# EAGLE design EnsembleNine (EAGLE 7.6.0)
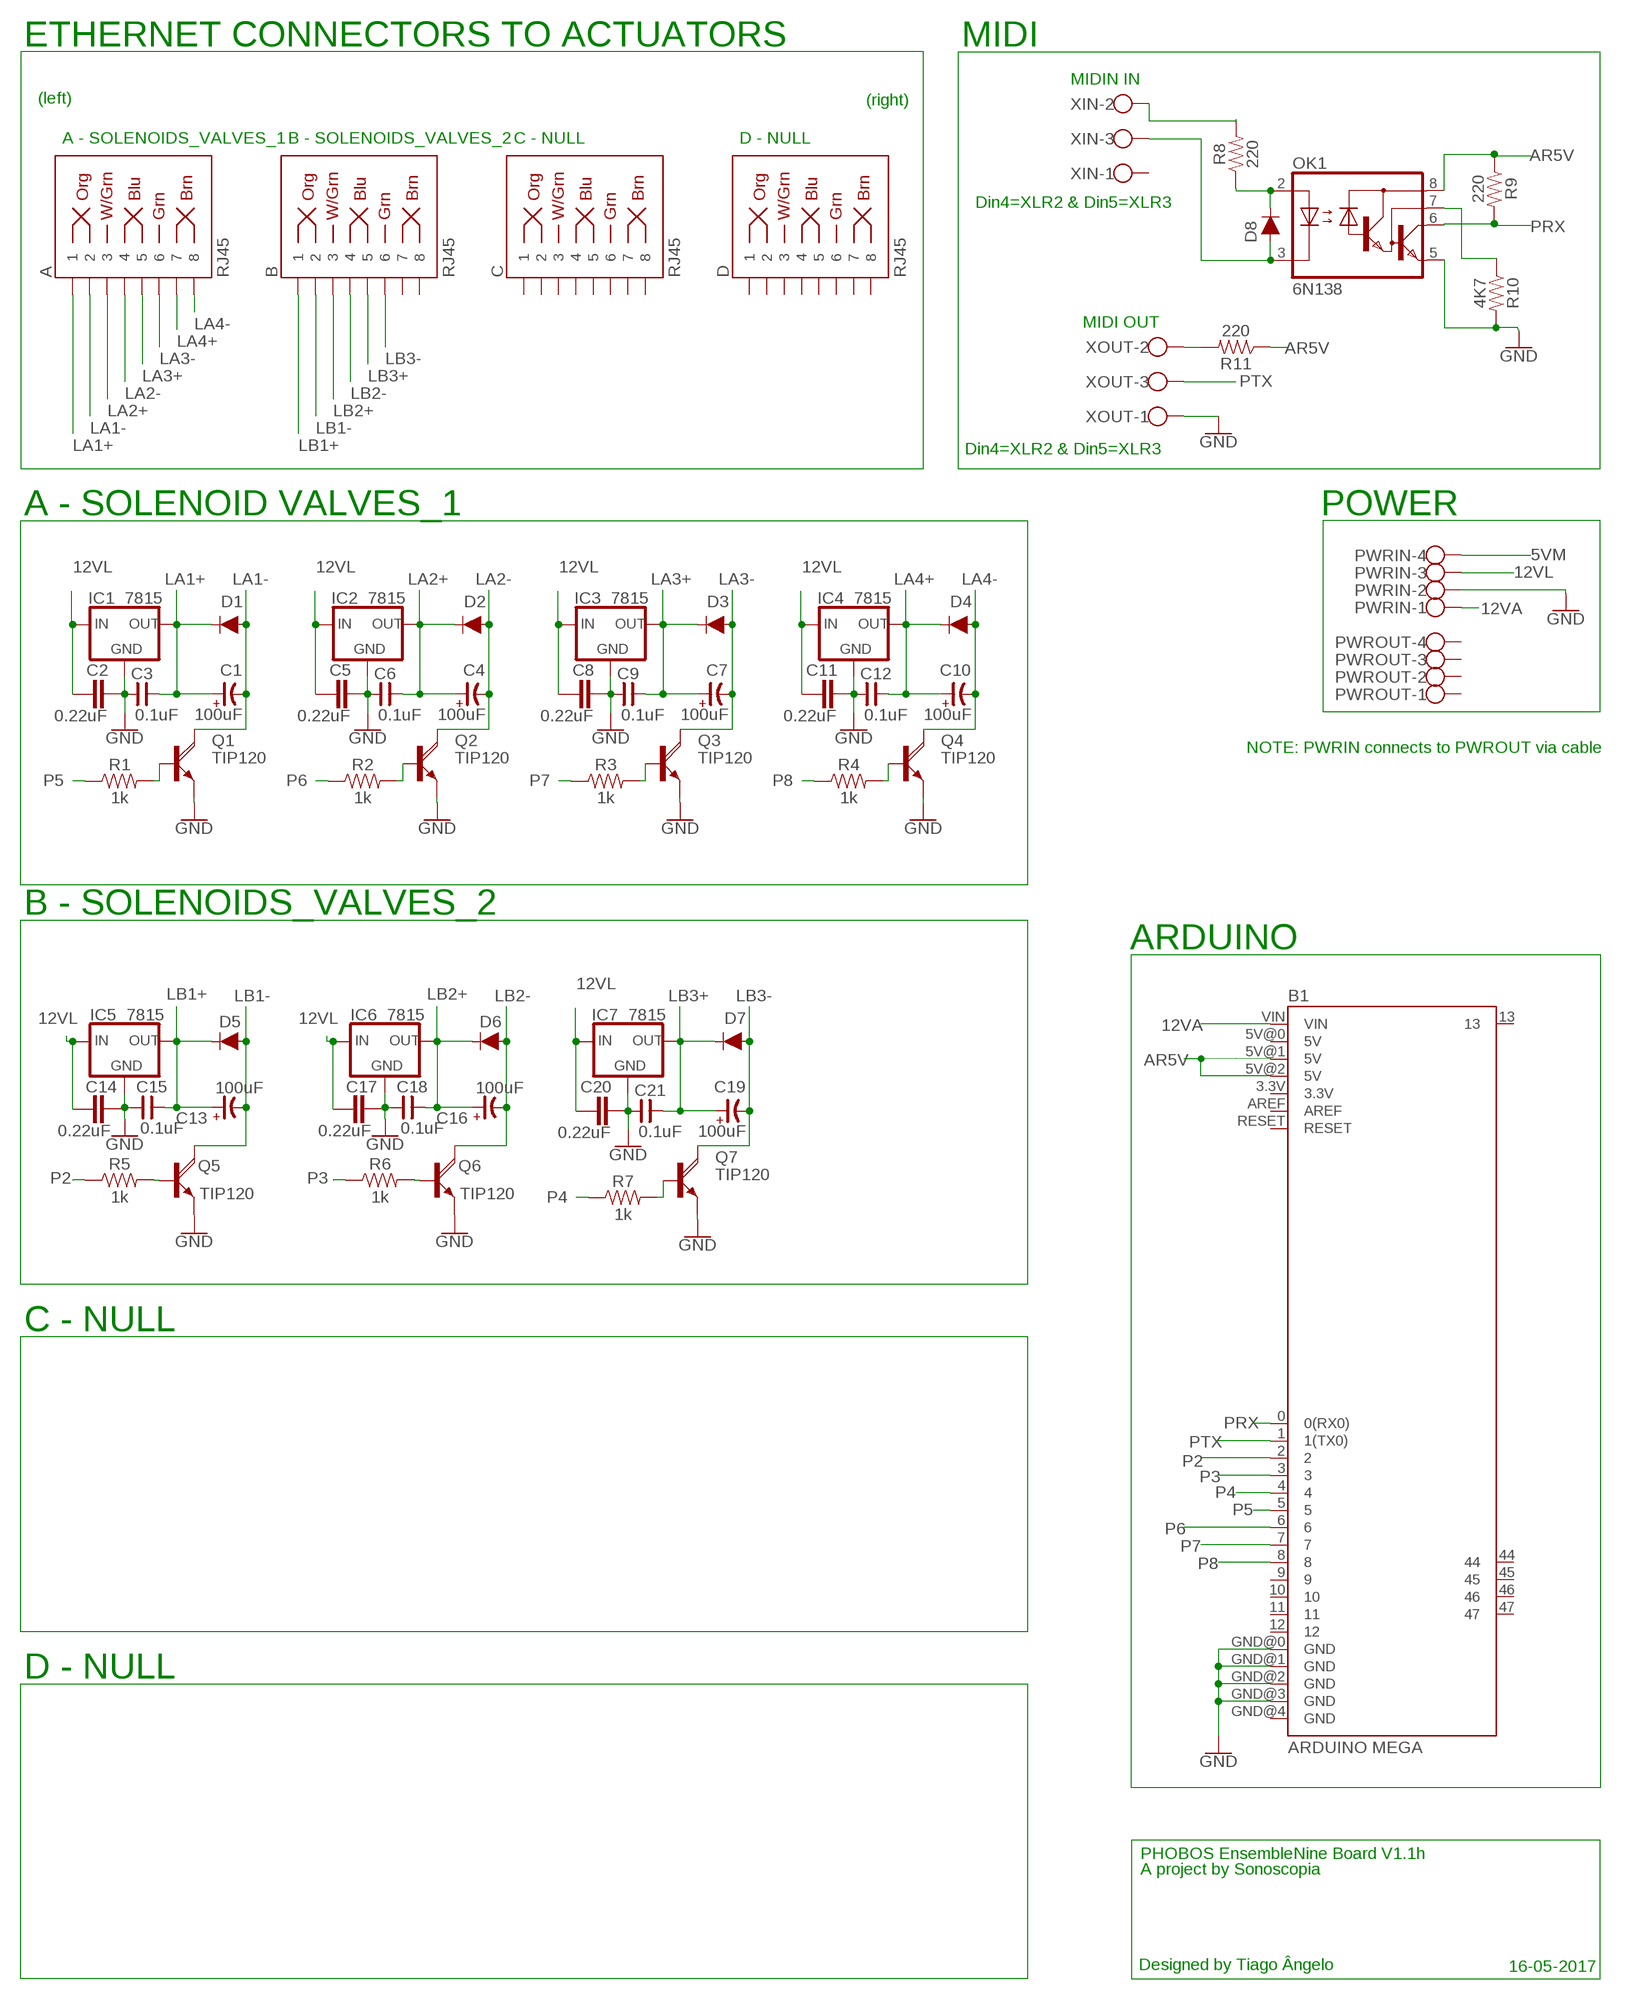
[diagram p0: schematic, sheet 1]

## Parts
A  RJ45  RJ45-8  [RJ45-8]
B  RJ45  RJ45-8  [RJ45-8]
B1  ARDUINO MEGA  ARDUINO_MEGA_R3FULL  [ARDUINO_MEGA]
C  RJ45  RJ45-8  [RJ45-8]
C1  100uF  CAP-MASTER_CP-E-020X050  [CAP-MASTER_E-020X050]
C2  0.22uF  C5/3  [C5B3]
C3  0.1uF  CNP-C025-050X025  [C025-050X025]
C4  100uF  CAP-MASTER_CP-E-020X050  [CAP-MASTER_E-020X050]
C5  0.22uF  C5/3  [C5B3]
C6  0.1uF  CNP-C025-050X025  [C025-050X025]
C7  100uF  CAP-MASTER_CP-E-020X050  [CAP-MASTER_E-020X050]
C8  0.22uF  C5/3  [C5B3]
C9  0.1uF  CNP-C025-050X025  [C025-050X025]
C10  100uF  CAP-MASTER_CP-E-020X050  [CAP-MASTER_E-020X050]
C11  0.22uF  C5/3  [C5B3]
C12  0.1uF  CNP-C025-050X025  [C025-050X025]
C13  100uF  CP-E-020X050  [E-020X050]
C14  0.22uF  C5/3  [C5B3]
C15  0.1uF  CNP-C025-050X025  [C025-050X025]
C16  100uF  CP-E-020X050  [E-020X050]
C17  0.22uF  C5/3  [C5B3]
C18  0.1uF  CNP-C025-050X025  [C025-050X025]
C19  100uF  CAP-MASTER_CP-E-020X050  [CAP-MASTER_E-020X050]
C20  0.22uF  C5/3  [C5B3]
C21  0.1uF  CNP-C025-050X025  [C025-050X025]
D  RJ45  RJ45-8  [RJ45-8]
D1  1A/50V/1.1V  DIODE-KIT2  [DIODE-1N4001-KIT]
D2  1A/50V/1.1V  DIODE-KIT2  [DIODE-1N4001-KIT]
D3  1A/50V/1.1V  DIODE-KIT2  [DIODE-1N4001-KIT]
D4  1A/50V/1.1V  DIODE-KIT2  [DIODE-1N4001-KIT]
D5  1A/50V/1.1V  DIODE-KIT2  [DIODE-1N4001-KIT]
D6  1A/50V/1.1V  DIODE-KIT2  [DIODE-1N4001-KIT]
D7  1A/50V/1.1V  DIODE-KIT2  [DIODE-1N4001-KIT]
D8  200mA/100V/1V  DIODE-1N4148  [DIODE-1N4148]
IC1  7815  78XXS  [78XXS]
IC2  7815  78XXS  [78XXS]
IC3  7815  78XXS  [78XXS]
IC4  7815  78XXS  [78XXS]
IC5  7815  78XXS  [78XXS]
IC6  7815  78XXS  [78XXS]
IC7  7815  78XXS  [78XXS]
OK1  6N138  [DIL08]
PWRIN  W237-4  [W237-4]
PWROUT  W237-4  [W237-4]
Q1  TIP120  ROCKETFARM_TIP120V  [ROCKETFARM_TO220AV]
Q2  TIP120  ROCKETFARM_TIP120V  [ROCKETFARM_TO220AV]
Q3  TIP120  ROCKETFARM_TIP120V  [ROCKETFARM_TO220AV]
Q4  TIP120  ROCKETFARM_TIP120V  [ROCKETFARM_TO220AV]
Q5  TIP120  TIP120V  [TO220AV]
Q6  TIP120  TIP120V  [TO220AV]
Q7  TIP120  ROCKETFARM_TIP120V  [ROCKETFARM_TO220AV]
R1  1k  1KOHM-VERT-1/4W-1%  [AXIAL-0.1]
R2  1k  1KOHM-VERT-1/4W-1%  [AXIAL-0.1]
R3  1k  1KOHM-VERT-1/4W-1%  [AXIAL-0.1]
R4  1k  1KOHM-VERT-1/4W-1%  [AXIAL-0.1]
R5  1k  1KOHM-VERT-1/4W-1%  [AXIAL-0.1]
R6  1k  1KOHM-VERT-1/4W-1%  [AXIAL-0.1]
R7  1k  1KOHM-VERT-1/4W-1%  [AXIAL-0.1]
R8  220  1KOHM-HORIZ-1/4W-5%  [AXIAL-0.3]
R9  220  1KOHM-HORIZ-1/4W-5%  [AXIAL-0.3]
R10  4K7  1KOHM-HORIZ-1/4W-5%  [AXIAL-0.3]
R11  220  1KOHM-HORIZ-1/4W-5%  [AXIAL-0.3]
XIN  W237-103  [W237-103]
XOUT  W237-103  [W237-103]

## Nets
5VM [5VM]: PWRIN.4
12VA [12VA]: B1.VIN PWRIN.1
12VL [12VL]: C2.1 C5.1 C8.1 C11.1 C14.1 C17.1 C20.1 IC1.IN IC2.IN IC3.IN IC4.IN IC5.IN IC6.IN IC7.IN PWRIN.3
AR5V: B1.5V@1(5V) B1.5V@2(5V) OK1.8(VCC) R9.P$1 R11.P$1
GND [GND]: B1.GND@0(GND) B1.GND@1(GND) B1.GND@2(GND) B1.GND@3(GND) C2.2 C3.1 C5.2 C6.1 C8.2 C9.1 C11.2 C12.1 C14.2 C15.1 C17.2 C18.1 C20.2 C21.1 IC1.GND IC2.GND IC3.GND IC4.GND IC5.GND IC6.GND IC7.GND OK1.5(GND) PWRIN.2 Q1.E Q2.E Q3.E Q4.E Q5.E Q6.E Q7.E R10.P$2 XOUT.1
LA1+: A.1 C1.+ C3.2 D1.C IC1.OUT
LA1-: A.2 C1.- D1.A Q1.C
LA2+: A.3 C4.+ C6.2 D2.C IC2.OUT
LA2-: A.4 C4.- D2.A Q2.C
LA3+: A.5 C7.+ C9.2 D3.C IC3.OUT
LA3-: A.6 C7.- D3.A Q3.C
LA4+: A.7 C10.+ C12.2 D4.C IC4.OUT
LA4-: A.8 C10.- D4.A Q4.C
LB1+: B.1 C13.+ C15.2 D5.C IC5.OUT
LB1-: B.2 C13.- D5.A Q5.C
LB2+: B.3 C16.+ C18.2 D6.C IC6.OUT
LB2-: B.4 C16.- D6.A Q6.C
LB3+: B.5 C19.+ C21.2 D7.C IC7.OUT
LB3-: B.6 C19.- D7.A Q7.C
N$1: Q3.B R3.P$2
N$2: R11.P$2 XOUT.2
N$3: Q4.B R4.P$2
N$4: Q6.B R6.P$2
N$9: Q5.B R5.P$2
N$16: Q7.B R7.P$2
N$18: Q1.B R1.P$2
N$19: Q2.B R2.P$2
N$25: D8.A OK1.3(C) XIN.3
N$26: D8.C OK1.2(A) R8.P$1
N$27: R8.P$2 XIN.2
N$29: OK1.7(VB) R10.P$1
P2: B1.2 R5.P$1
P3: B1.3 R6.P$1
P4: B1.4 R7.P$1
P5: B1.5 R1.P$1
P6: B1.6 R2.P$1
P7: B1.7 R3.P$1
P8: B1.8 R4.P$1
PRX: B1.0(0(RX0)) OK1.6(VO) R9.P$2
PTX: B1.1(1(TX0)) XOUT.3
Unconnected: B1.3.3V B1.5V@0(5V) B1.9 B1.10 B1.11 B1.12 B1.13 B1.44 B1.45 B1.46 B1.47 B1.AREF B1.GND@4(GND) B1.RESET B.7 B.8 C.1 C.2 C.3 C.4 C.5 C.6 C.7 C.8 D.1 D.2 D.3 D.4 D.5 D.6 D.7 D.8 PWROUT.1 PWROUT.2 PWROUT.3 PWROUT.4 XIN.1

## Notes on the sheet
- ETHERNET CONNECTORS TO ACTUATORS | MIDI
- MIDIN IN
- (left) | (right)
- A - SOLENOIDS_VALVES_1 | B - SOLENOIDS_VALVES_2 | C - NULL | D - NULL
- Din4=XLR2 & Din5=XLR3
- MIDI OUT
- Din4=XLR2 & Din5=XLR3
- A - SOLENOID VALVES_1 | POWER
- NOTE: PWRIN connects to PWROUT via cable
- B - SOLENOIDS_VALVES_2
- ARDUINO
- C - NULL
- D - NULL
- PHOBOS EnsembleNine Board V1.1h
- A project by Sonoscopia
- Designed by Tiago Ângelo | 16-05-2017

## Library data of the parts
A B C D = SparkFun-Connectors:RJ45-8: RJ45 Jack - 8 pin Simple RJ45, 8-pin connection. Commonly used for Cat5, Cat5e, and Cat6 Ethernet cables. Here is the connector we sell at SparkFun: RJ45 8-Pin Connector <https://www.sparkfun.com/products/643> (PRT-00643) Datasheet <https://cdn.sparkfun.com/datasheets/Prototyping/04908.pdf> It is used on this SparkFun product: SparkFun RJ45 Breakout <https://www.sparkfun.com/products/716> (BOB-00716) Note, you may also be interested in the "MAGJACK" version of this. It is basically a RJ45 connector, but also has some status LEDs built into the connector housing. You can check that out in this library at the device named "MAGJACK.dev" and see these products online: RJ45 Ethernet MagJack-Compatible <https://www.sparkfun.com/products/8534> (PRT-08534) SparkFun RJ45 MagJack Breakout <https://www.sparkfun.com/products/13021> (BOB-13021); PROD_ID: CONN-08506; SF_ID: PRT-00643
B1 = PHOBOS-Boards:ARDUINO_MEGA_R3: Arduino Mega R3 ATmega2560 R3 compatible footprint. SparkFun Products: Arduino Mega 2560 R3 <https://www.sparkfun.com/products/11061>
C1 C4 C7 C10 C19 = PHOBOS-lbr:CAP-MASTER_CP-: POLARIZED CAP
C2 C5 C8 C11 C14 C17 C20 = capacitor-wima:C: CAPACITOR naming: grid - package width
C3 C6 C9 C12 C15 C18 C21 = cap-master:CNP-: NON-POLARIZED CAP
C13 C16 = cap-master:CP-: POLARIZED CAP
D1-D7 = SparkFun-DiscreteSemi:DIODE: Diode These are standard reverse protection diodes and small signal diodes. SparkFun Products: SparkFun SparkPunk Sound Kit <https://www.sparkfun.com/products/11177> SparkFun ESP8266 Thing <https://www.sparkfun.com/products/13231>; PROD_ID: DIO-09176
D8 = SparkFun-DiscreteSemi:DIODE: Diode These are standard reverse protection diodes and small signal diodes. SparkFun Products: SparkFun SparkPunk Sound Kit <https://www.sparkfun.com/products/11177> SparkFun ESP8266 Thing <https://www.sparkfun.com/products/13231>; PROD_ID: DIO-08378
IC1-IC7 = v-reg:78XXS: VOLTAGE REGULATOR
OK1 = optocoupler:6N138: MOTOROLA OPTO COUPLER; MF: VISHAY/TELEFUNKEN; MPN: 6N138; OC_FARNELL: 9860150; OC_NEWARK: 35K5294
PWRIN PWROUT = con-wago-500:W237-4: WAGO SCREW CLAMP; OC_FARNELL: unknown; OC_NEWARK: unknown
Q1-Q4 Q7 = PHOBOS-lbr:ROCKETFARM_TIP120: NPN DARLINGTON TRANSISTOR
Q5 Q6 = rocketfarm:TIP120: NPN DARLINGTON TRANSISTOR
R1-R7 = SparkFun-Resistors:1KOHM: 1kΩ resistor A resistor is a passive two-terminal electrical component that implements electrical resistance as a circuit element. Resistors act to reduce current flow, and, at the same time, act to lower voltage levels within circuits. - Wikipedia; PROD_ID: RES-12182
R8-R11 = SparkFun-Resistors:1KOHM: 1kΩ resistor A resistor is a passive two-terminal electrical component that implements electrical resistance as a circuit element. Resistors act to reduce current flow, and, at the same time, act to lower voltage levels within circuits. - Wikipedia; PROD_ID: RES-08380; VALUE: 1k
XIN XOUT = con-wago-500:W237-103: WAGO SCREW CLAMP; MPN: 237-103; OC_FARNELL: unknown; OC_NEWARK: 18M7116

## Net classes
0 default: width 0.508 mm, drill 0.508 mm, clearance 0.406 mm
1 GND: width 1.016 mm, drill 0.508 mm, clearance 0.508 mm
2 5VM: width 1.016 mm, drill 0.508 mm, clearance 0.508 mm
3 12VL: width 0.61 mm, drill 0.508 mm, clearance 0.508 mm
4 12VA: width 0.508 mm, drill 0.508 mm, clearance 0.508 mm

## Board
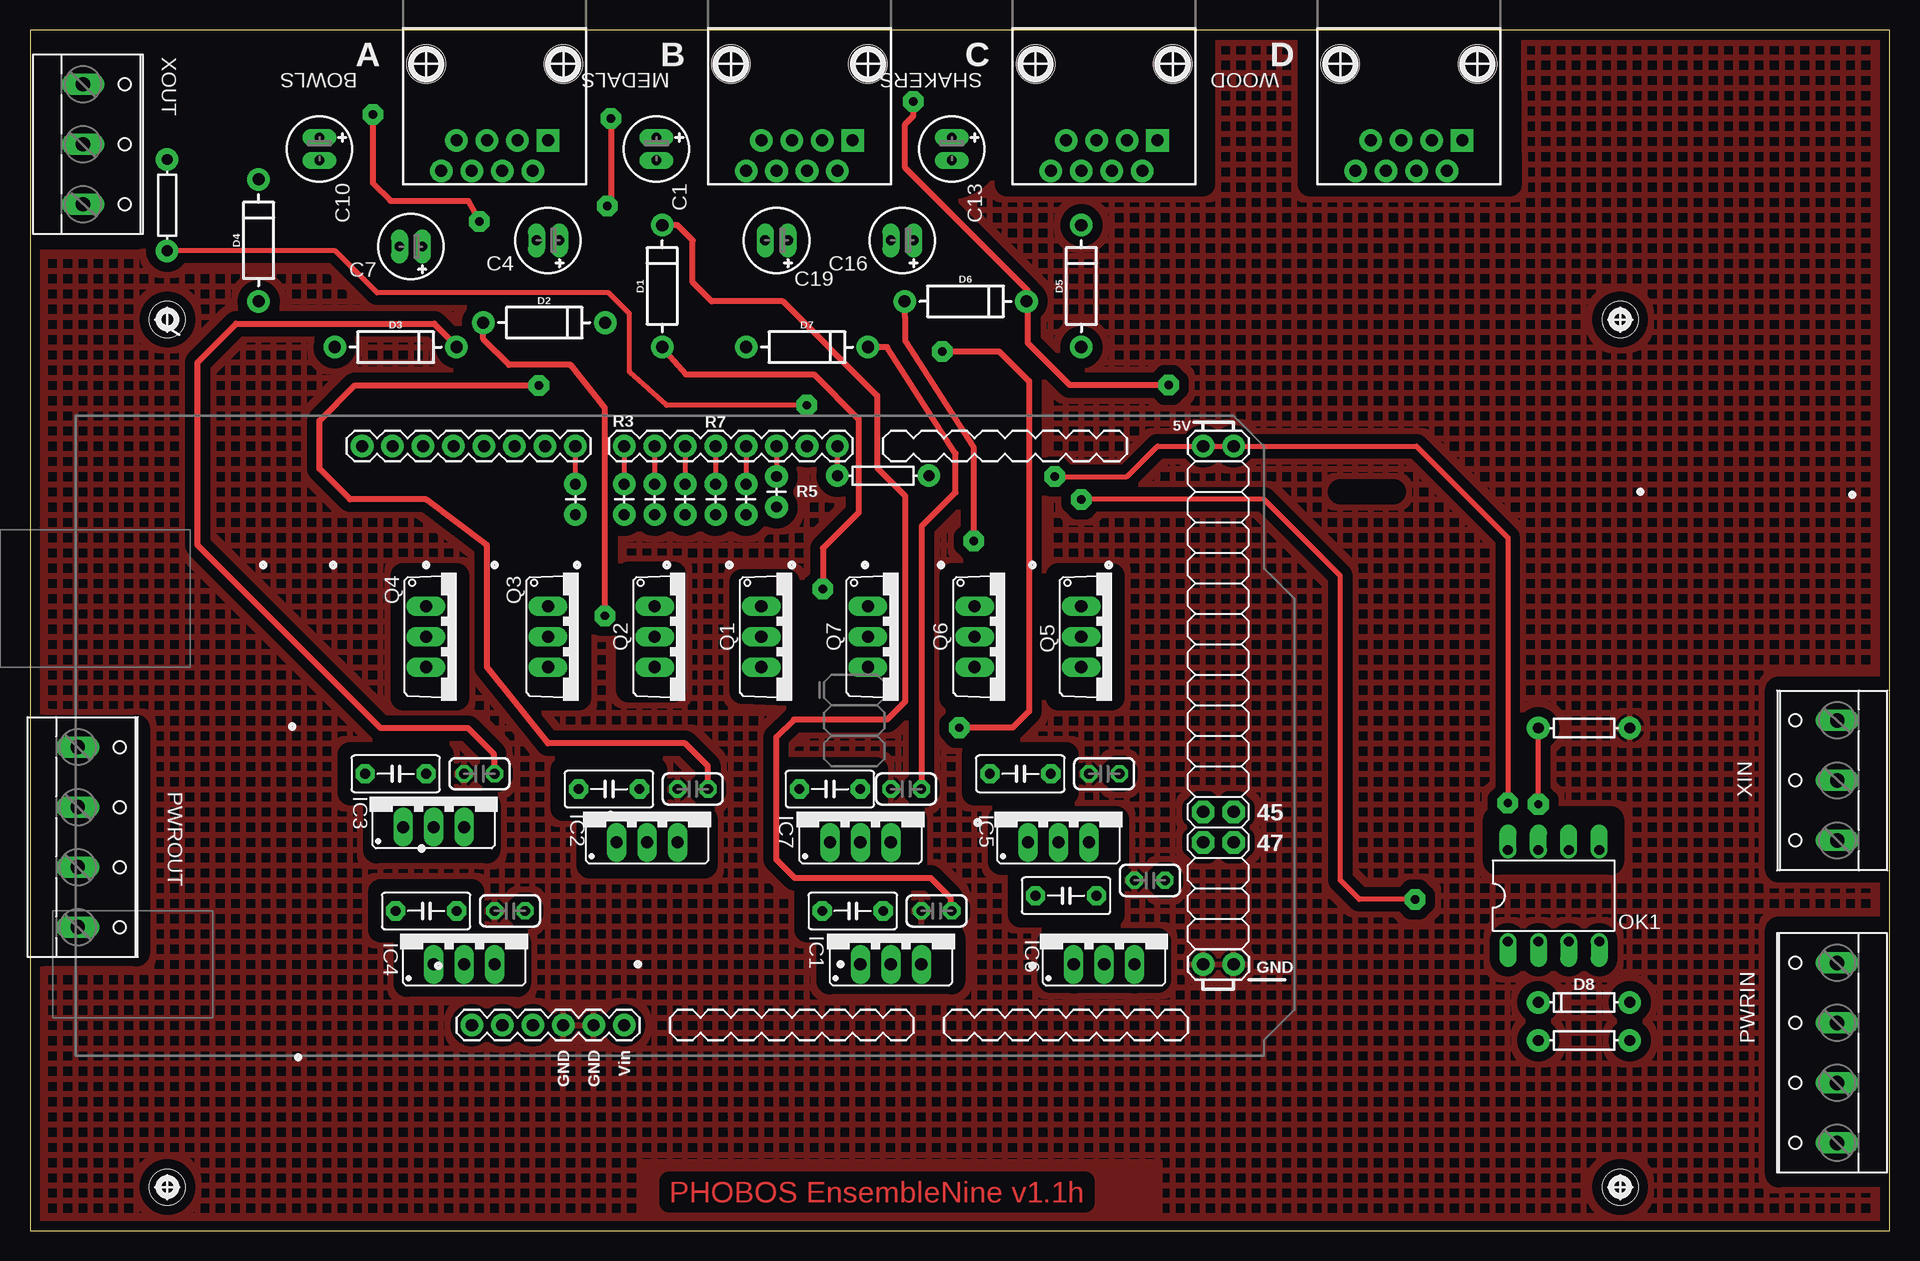
[diagram p1: board, top side]
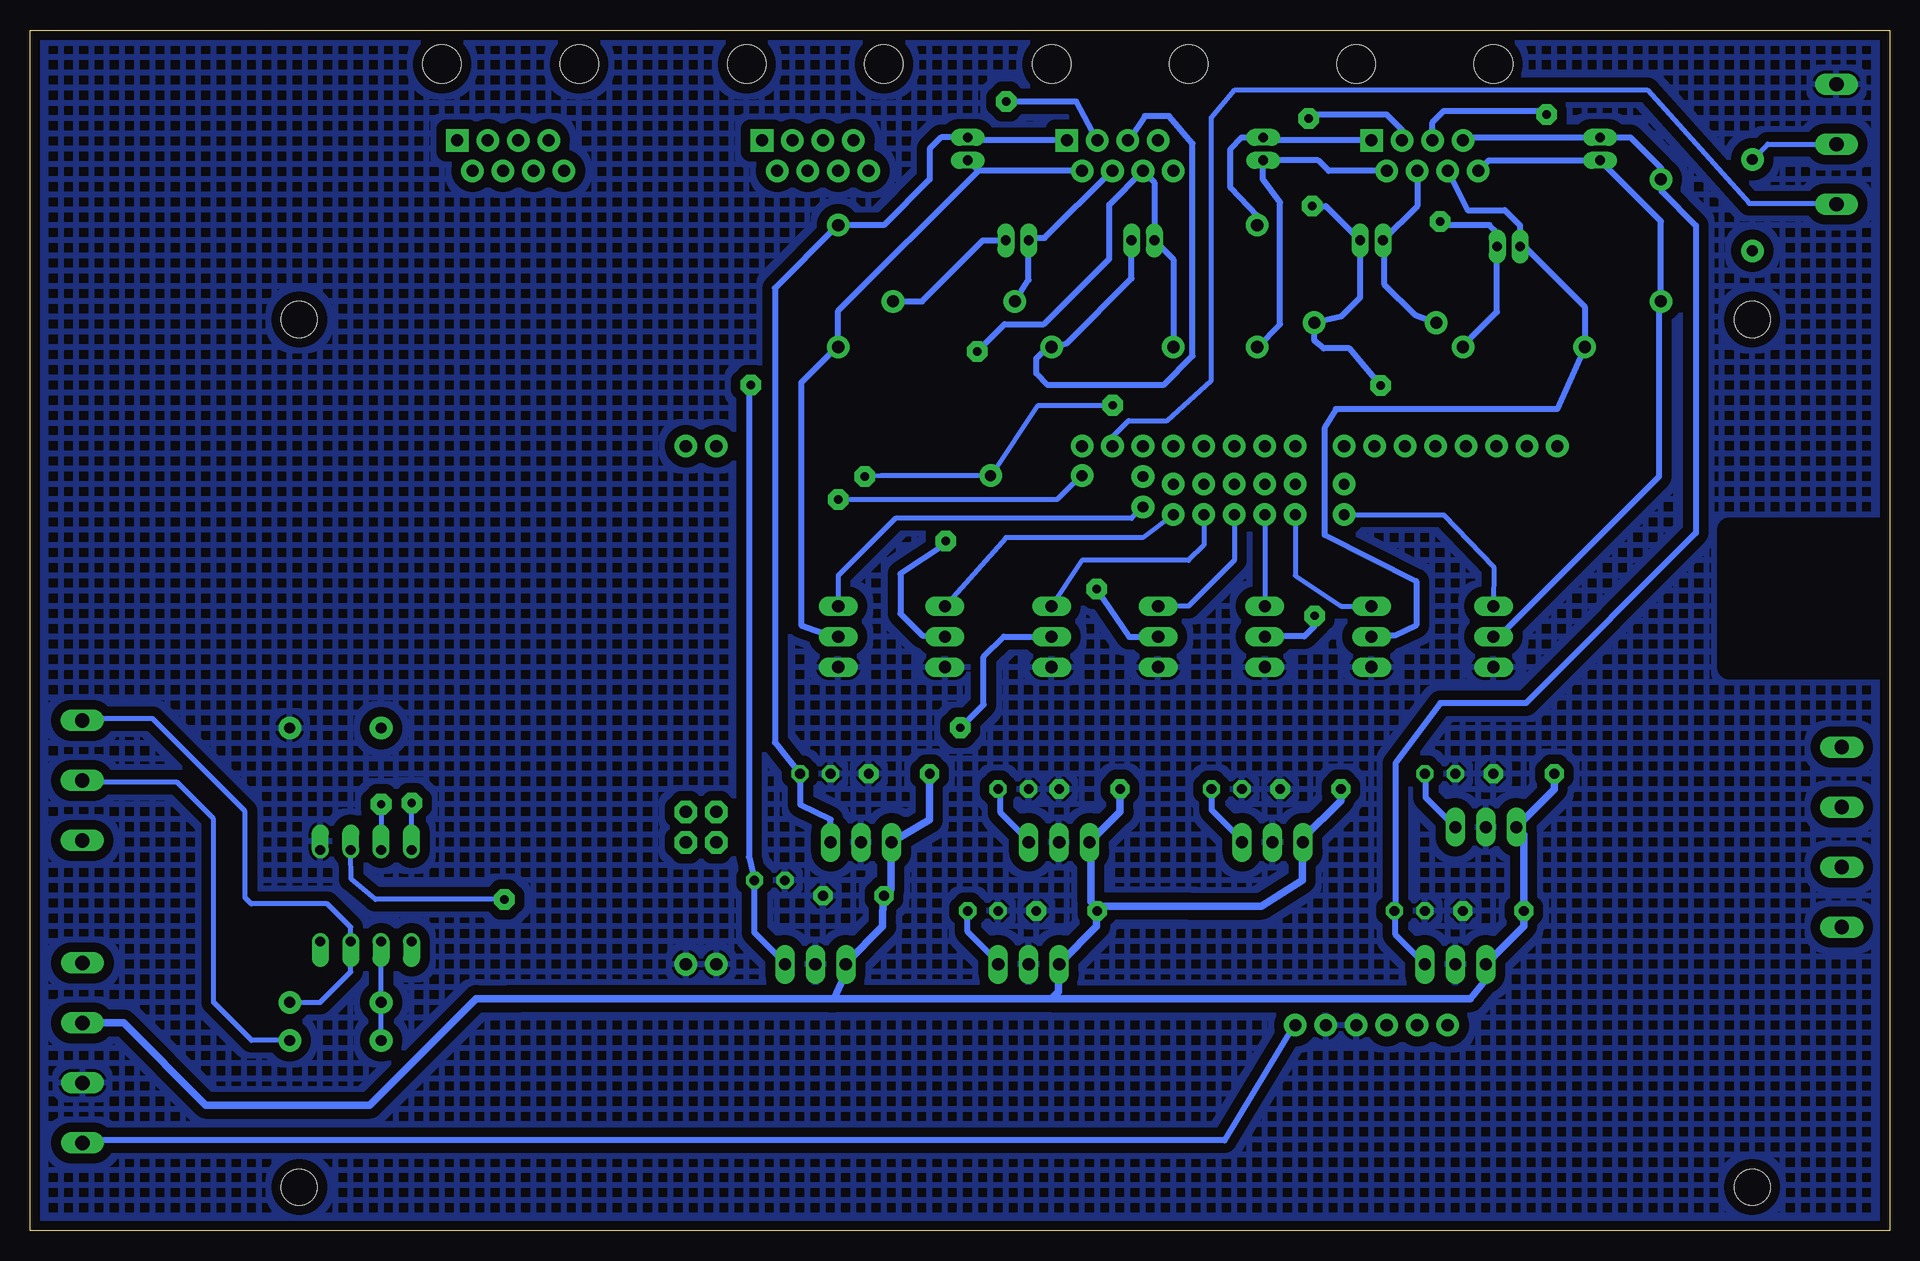
[diagram p2: board, bottom side, seen from below]

Size 155 x 100.08 mm. Coordinates in mm from the lower left corner, seen from the top.
Outline: 0,0 155,0 155,100.08 0,100.08 0,0
Copper layers (1*16): Top 0.035mm / dielectric 1.5mm / Bottom 0.035mm
Design rules "Dek": minimum track width 12mil, minimum drill 36mil, track to track 12mil, track to pad 12mil, pad to pad 12mil, via to via 12mil, smd to smd 0mil, copper to edge 10mil, drill to drill 12mil, minimum pad ring 12mil, minimum via ring 20mil, stop-mask expansion 4mil, vias tented up to drill 25mil, thermal gap 10mil
Holes 3 mm at 132.55,75.95 132.55,3.65 11.45,3.65 11.45,75.95
Holes 1.5 mm at -15.24,52.07 193.04,6.35 193.04,93.98
tRestrict: area 30.5,86.4 to 47,108; area 55.9,86.4 to 72.4,108; area 81.3,87.2 to 97.8,108; area 106.7,87.2 to 123.4,108; area 122.2,30.8 to 131.8,34.3; area 1,23.2 to 8.9,41.9; area 145.7,4.8 to 154.6,25.1; area 145.7,30.2 to 154.9,45.1; area 66.7,20.8 to 76.8,24.4; area 85.1,20.9 to 94,24.1; area 81,30.8 to 90.5,34.3; area 64.1,30.5 to 73.7,34.3; 27 more areas
bRestrict: area -2.5,47 to 13.3,58.4
vRestrict: area 71.1,64.1 to 91.4,66.7; area 96.5,36.2 to 101.6,64.1; area 96.5,23.5 to 101.6,31.1; area 53.3,15.9 to 73.7,18.4; area 76.2,15.9 to 96.5,18.4; area -2.5,47 to 13.3,58.4; area 122.2,25.1 to 132.1,30.8; area 10.8,82.9 to 12.1,87.9; area 17.8,79.5 to 20.2,85.7; area 39.6,74.5 to 45.7,77; area 61.5,72.5 to 67.9,74.9; area 51.6,75.7 to 54,81.9; 3 more areas

### Footprints (pad centres in the part's own frame; a part is rotated, then mirrored left to right if it is on the bottom)
RJ45-8 = drill 1 pad 1.88 square: 1 -4.445,6.35 | drill 1 pad 1.88: 2 -3.175,8.89; 3 -1.905,6.35; 4 -0.635,8.89; 5 0.635,6.35; 6 1.905,8.89; 7 3.175,6.35; 8 4.445,8.89 | hole 3.2: -5.715,0; 5.715,0
ARDUINO_MEGA = drill 1.016 pad 1.88: 0 13.97,24.13; 1 11.43,24.13; 2 8.89,24.13; 3 6.35,24.13; 3.3V -13.97,-24.13; 4 3.81,24.13; 5 1.27,24.13; 5V@0 -11.43,-24.13; 5V@1 44.45,24.13; 5V@2 46.99,24.13; 6 -1.27,24.13; 7 -3.81,24.13; 8 -7.874,24.13; 9 -10.414,24.13; 10 -12.954,24.13; 11 -15.494,24.13; 12 -18.034,24.13; 13 -20.574,24.13; AREF -25.654,24.13; GND@0 -8.89,-24.13; GND@1 -6.35,-24.13; GND@2 44.45,-19.05; GND@3 46.99,-19.05; GND@4 -23.114,24.13; RESET -16.51,-24.13; VIN -3.81,-24.13 | drill 1.016 pad 1.88 octagon: 44 44.45,-6.35; 45 46.99,-6.35; 46 44.45,-8.89; 47 46.99,-8.89
CAP-MASTER_E-020X050 = drill 0.813 long: + -0.953,0; - 0.953,0
C5B3 = drill 0.813 pad 1.6 octagon: 1 -2.54,0; 2 2.54,0
C025-050X025 = drill 0.813 pad 1.422 octagon: 1 -1.27,0; 2 1.27,0
E-020X050 = drill 0.813 long: + -0.953,0; - 0.953,0
DIODE-1N4001-KIT = drill 1.016 pad 1.88: A -5.08,0; C 5.08,0
DIODE-1N4148 = drill 0.9 pad 1.88: A -3.81,0; C 3.81,0
78XXS = drill 1.016 long: GND 0,-2.54; IN -2.54,-2.54; OUT 2.54,-2.54
DIL08 = drill 0.813 offset: 1 -3.81,-3.81; 2 -1.27,-3.81; 3 1.27,-3.81; 4 3.81,-3.81; 5 3.81,3.81; 6 1.27,3.81; 7 -1.27,3.81; 8 -3.81,3.81
W237-4 = drill 1.194 long: 1 -7.5,-1.27; 2 -2.5,-1.27; 3 2.5,-1.27; 4 7.5,-1.27
ROCKETFARM_TO220AV = drill 1.016 long: B -2.54,-2.54; C 0,-2.54; E 2.54,-2.54
TO220AV = drill 1.016 long: B -2.54,-2.54; C 0,-2.54; E 2.54,-2.54
AXIAL-0.1 = drill 0.9 pad 1.88: P$1 -1.27,0; P$2 1.27,0
AXIAL-0.3 = drill 0.9 pad 1.88: P$1 -3.81,0; P$2 3.81,0
W237-103 = drill 1.194 long: 1 -5,-1.29; 2 0,-1.29; 3 5,-1.29

### Placement (x,y rotation side)
A  38.73,97.23 180 top
B  64.13,97.23 180 top
B1  53.34,41.27 0 top
C  89.53,97.23 180 top
C1  52.22,90.17 270 top
C2  68.58,26.67 0 top
C3  75.56,26.67 0 top
C4  43.18,82.55 180 top
C5  48.26,36.83 0 top
C6  55.24,36.83 0 top
C7  31.75,82.04 180 top
C8  30.48,38.1 0 top
C9  37.46,38.1 0 top
C10  24.13,90.17 270 top
C11  33.02,26.67 0 top
C12  40.01,26.67 0 top
C13  76.84,90.17 270 top
C14  82.55,38.1 0 top
C15  89.53,38.1 0 top
C16  72.71,82.55 180 top
C17  86.36,27.94 0 top
C18  93.34,29.21 0 top
C19  62.23,82.55 180 top
C20  66.68,36.83 0 top
C21  73.03,36.83 0 top
D  114.94,97.23 180 top
D1  52.71,78.74 90 top
D2  42.86,75.69 0 top
D3  30.48,73.66 0 top
D4  19.05,82.55 90 top
D5  87.63,78.74 90 top
D6  77.98,77.47 0 top
D7  64.77,73.66 0 top
D8  129.54,19.05 180 top
IC1  71.75,24.77 0 top
IC2  51.43,34.92 0 top
IC3  33.66,36.2 0 top
IC4  36.2,24.77 0 top
IC5  85.72,34.92 0 top
IC6  89.53,24.77 0 top
IC7  69.22,34.92 0 top
OK1  127,27.94 0 top
PWRIN  149.35,14.84 90 top
PWROUT  5.25,32.82 270 top
Q1  63.5,49.53 270 top
Q2  54.61,49.53 270 top
Q3  45.72,49.53 270 top
Q4  35.56,49.53 270 top
Q5  90.17,49.53 270 top
Q6  81.28,49.53 270 top
Q7  72.39,49.53 270 top
R1  54.61,60.96 270 top
R2  52.07,60.96 270 top
R3  49.53,60.96 270 top
R4  45.47,60.96 270 top
R5  62.23,61.59 270 top
R6  59.69,60.96 270 top
R7  57.15,60.96 270 top
R8  129.54,15.88 0 top
R9  71.12,62.94 180 top
R10  129.54,41.91 0 top
R11  11.43,85.48 90 top
XIN  149.35,37.54 90 top
XOUT  5.71,90.56 270 top

### Tracks (layer width: path | path; a pad name or v marks a point on that pad's centre or on a via)
12VA
  Bottom 0.508: PWRIN.1 150.44,7.54 55.42,7.54 49.63,17.14 B1.VIN
12VL
  Bottom 0.61: 79.81,38.18 C14.1 80.03,37.95 80.03,34.27 IC5.IN 83.24,32.23 83.24,28.47 83.69,28.02 C17.1 83.92,26.52 83.92,25.38 86.89,22.4 IC6.IN 86.89,21.95 86.89,21.72 88,19.34 88.26,19.34 | C2.1 66.09,26.52 66.09,25.38 69.06,22.4 IC1.IN 69.29,21.95 69.29,19.93 69.85,19.37 | C2.1 65.86,26.75 65.74,27.06 58.42,27.08 52.35,27.08 48.95,29.21 48.95,32.11 IC2.IN 48.95,32.66 45.74,35.87 45.74,36.78 C5.1 | C20.1 64.13,34.92 IC7.IN 66.55,32.21 66.55,27.43 66.09,26.98 C2.1 | 88.26,19.34 114.3,19.34 | 114.3,19.34 115.28,19.34 | PWRIN.3 147.2,17.34 140.34,10.48 126.68,10.48 117.79,19.37 114.33,19.37 114.3,19.34 | 69.85,19.37 88.24,19.37 88.26,19.34 | C8.1 27.94,36.83 IC3.IN 30.48,33.02 C11.1 30.48,25.4 IC4.IN 33.66,20.95 34.92,19.37 69.85,19.37
AR5V  (via drill 0.7)
  Top 0.406: v64.76,68.81 53.05,68.81 49.97,71.56 49.97,76.45 48.25,78.18 28.93,78.18 25.44,81.67 R11.P$1 | v123.18,35.66 v123.19,35.67 123.19,57.78 115.57,65.41 B1.5V@2 B1.5V@1 93.98,65.41 91.44,62.87 v85.41,62.87
  Bottom 0.406: OK1.8 v123.18,35.66 | v64.76,68.81 70.97,68.81 74.78,63.09 | R9.P$1 84.06,62.94 v85.41,62.87
  Bottom 0.508: 74.78,63.09 R9.P$1
GND
  pour Bottom (isolate 0.813, rank 2, hatched): -5.08,104.14 160.02,104.14 160.02,0 -5.08,0
  pour Top (isolate 0.813, hatched): 0,100.33 154.94,100.33 154.94,0 0,0
LA1+
  Top 0.508: 76.84,26.75 C3.2 76.72,26.78 76.72,27.77 75.06,29.43 63.74,29.43 62.21,30.96 62.21,41.15 63.68,42.62 71.45,42.62 72.95,44.12 72.95,61.27 70.61,63.6 70.61,69.62 62.76,77.47 56.83,77.47 55.24,79.06 55.24,82.55 53.98,83.82 D1.C
  Bottom 0.508: C3.2 76.84,24.92 74.32,22.4 IC1.OUT | A.1 51.19,90.88 C1.+ 54,91.12 54.93,90.17 54.93,86.92 52.71,84.55 D1.C
LA1-  (via drill 0.7)
  Top 0.508: v66.09,53.49 66.09,56.9 69.06,59.87 69.06,67.65 65.34,71.37 54.67,71.37 D1.A
  Bottom 0.508: 62.36,49.66 Q1.C 63.39,49.52 v66.09,53.49 | A.2 46.75,88.34 47.62,89.22 C1.- 52.24,87.66 50.8,85.72 50.8,75.56 D1.A
LA2+  (via drill 0.7)
  Top 0.508: v48.43,92.71 48.43,85.72 v48.11,85.41 | C6.2 56.51,38.73 54.61,40.64 43.18,40.64 38.1,46.99 38.1,57.15 33.02,60.96 26.67,60.96 24.13,63.5 24.13,67.53 27.07,70.47 v42.43,70.47
  Bottom 0.508: C6.2 56.49,36.68 56.49,35.08 53.98,32.56 IC2.OUT | A.3 40.64,91.76 41.91,93.03 47.82,93.03 v48.43,92.71 | v48.11,85.41 46.99,85.41 C4.+ 44.13,77.79 45.72,76.2 D2.C 47.92,74.17 47.16,73.55 45,73.55 v42.43,70.47
LA2-  (via drill 0.7)
  Top 0.508: v47.92,51.26 47.92,68.58 45.07,72.18 39.93,72.18 37.78,74.33 D2.A
  Bottom 0.508: A.4 39.37,85.41 C4.- 42.09,82.53 42.09,78.87 39.57,76.35 D2.A | v47.92,51.26 47.92,50.41 48.77,49.55 52.05,49.55 Q2.C
LA3+  (via drill 0.7)
  Top 0.508: C9.2 38.66,39.76 36.51,41.91 29.21,41.91 13.97,57.15 13.97,72.39 17.18,75.6 33.69,75.6 35.56,73.74 D3.C | v28.58,93.03 28.58,87.31 30.04,85.85 36.54,85.85 v37.46,84.14
  Bottom 0.508: IC3.OUT 38.66,36.12 38.66,37.95 C9.2 | D3.C 35.46,73.84 32.71,76.58 32.71,82.53 C7.+ 32.7,83.19 33.34,83.82 36.83,83.82 37.15,84.14 v37.46,84.14 | A.5 38.1,92.39 37.15,93.34 28.89,93.34 v28.58,93.03
LA3-
  Bottom 0.508: A.6 35.17,85.06 32.07,85.06 30.8,83.8 C7.- 30.89,82.53 25.4,77.04 D3.A 25.4,73.61 27.7,68.49 46.16,68.49 47.09,66.92 47.09,58 39.45,54.15 39.45,50.48 41.27,49.61 43,49.61 Q3.C
LA4+
  Bottom 0.508: IC4.OUT 38.89,22.4 41.17,24.69 41.17,26.52 C12.2 41.17,26.75 41.17,38.99 37.44,43.99 30.3,43.99 16.13,58.17 16.13,83.77 19,86.64 19,87.55 D4.C 19.05,88.58 21.59,91.12 C10.+ 35.32,91.12 A.7
LA4-
  Bottom 0.508: A.8 33.41,89.22 C10.- 19.05,84.14 D4.A 19.23,77.27 19.23,62.87 32.49,49.61 32.94,49.61 Q4.C
LB1+
  Bottom 0.508: IC5.OUT 88.26,34.29 90.78,35.53 90.78,37.95 C15.2 92.91,40.72 92.91,78.56 87.81,83.67 D5.C 83.82,83.82 80.01,87.63 80.01,90.17 79.06,91.12 C13.+ 76.59,90.88 B.1
LB1-
  Bottom 0.508: B.2 75.96,88.34 | 75.96,88.34 C13.- | 75.96,88.34 87.63,76.67 D5.A 87.81,73.61 90.73,70.69 90.73,50.48 88.26,49.61 87.81,49.61 Q5.C
LB2+  (via drill 0.7)
  Top 0.508: v73.63,94.13 73.63,92.93 72.95,92.24 72.95,88.59 83.19,78.36 83.19,77.59 D6.C 83.19,77.35 83.19,73.98 86.68,70.48 v94.93,70.48
  Bottom 0.508: IC6.OUT 92.15,22.4 94.62,24.87 C18.2 95.07,31.17 95.07,70.03 v94.93,70.48 | D6.C 80.65,77.47 75.56,82.55 C16.+ | v73.63,94.13 67.81,94.13 66.14,91.03 66.09,90.98 B.3
LB2-  (via drill 0.7)
  Top 0.508: v78.66,57.48 78.66,65.29 72.95,74.18 72.95,76.12 D6.A
  Bottom 0.508: D6.A 71.75,79.25 C16.- 71.35,82.75 70.43,82.75 64.95,88.24 B.4 | v78.66,57.48 78.66,57.28 82.45,54.76 82.45,51.44 80.62,49.61 78.89,49.61 Q6.C
LB3+
  Top 0.508: C21.2 74.32,37.03 74.32,58.73 77.15,61.56 77.15,64.77 71.44,73.66 D7.C
  Bottom 0.508: 74.09,36.68 C21.2 74.09,36.58 74.09,34.85 71.81,32.56 IC7.OUT | C19.+ 63.18,79.38 68.58,73.98 D7.C 70.17,73.66 71.12,72.71 71.12,71.44 70.17,70.48 60.53,70.48 58.09,72.92 58.09,90.61 60.06,92.9 62.07,92.9 63.35,90.98 B.5
LB3-  (via drill 0.7)
  Top 0.508: v77.44,41.94 81.9,41.94 83.27,43.31 83.27,70.81 80.81,73.28 v76.05,73.28
  Bottom 0.508: D7.A 59.69,80.96 C19.- 61.28,87.39 B.6 65.04,85.53 65.04,81.01 70.49,75.56 73.76,75.56 v76.05,73.28 | 69.98,49.38 Q7.C 73.82,49.53 75.52,47.84 75.52,43.86 v77.44,41.94
N$1
  Bottom 0.406: R3.P$2 49.53,54.61 45.72,52.07 Q3.B
N$2
  Bottom 0.406: R11.P$2 10.16,90.56 XOUT.2
N$3
  Bottom 0.406: R4.P$2 37.17,59.68 32.99,55.33 Q4.B
N$4
  Bottom 0.406: R6.P$2 62.23,57.78 73.66,57.78 Q6.B
N$6
  pour Top (isolate 0.813): 50.98,5.78 94.16,5.78 94.16,0.7 50.98,0.7
N$9
  Bottom 0.406: R5.P$2 63.18,59.37 82.87,59.37 87.63,54.61 Q5.B
N$16
  Bottom 0.406: R7.P$2 57.15,57.15 58.42,55.88 67.31,55.88 Q7.B
N$18
  Bottom 0.406: R1.P$2 54.61,55.88 58.42,52.07 Q1.B
N$19
  Bottom 0.406: R2.P$2 Q2.B
N$25
  Bottom 0.406: D8.A 130.81,19.05 128.27,21.59 OK1.3 128.27,25.32 130.21,27.26 136.56,27.26 137.07,27.77 137.07,34.98 144.79,42.69 150.49,42.69 XIN.3
N$26
  Bottom 0.406: OK1.2 D8.C R8.P$1
N$27
  Bottom 0.406: R8.P$2 136.53,15.88 139.7,19.05 139.7,34.35 142.73,37.38 150.48,37.38 XIN.2
N$29  (via drill 0.7)
  Top 0.406: v125.73,35.56 R10.P$1
  Bottom 0.406: v125.73,35.56 OK1.7
P2
  Top 0.406: B1.2 R5.P$1
P3
  Top 0.406: B1.3 R6.P$1
P4
  Top 0.406: B1.4 R7.P$1
P5
  Top 0.406: B1.5 R1.P$1
P6
  Top 0.406: B1.6 R2.P$1
P7
  Top 0.406: B1.7 R3.P$1
P8
  Top 0.406: R4.P$1 B1.8
PRX  (via drill 0.7)
  Top 0.406: R9.P$2 B1.0 | v115.47,27.64 110.8,27.64 109.22,29.21 109.22,54.61 102.87,60.96 v87.63,60.96
  Bottom 0.406: v115.47,27.64 126.21,27.64 128.22,29.32 128.27,31.55 OK1.6 | R9.P$2 67.46,62.87 69.37,60.96 v87.63,60.96
PTX
  Bottom 0.406: XOUT.3 4.55,85.64 11.7,85.64 20.19,95.08 54.56,95.08 56.54,92.79 56.54,70.88 60.21,67.53 63.44,67.53 64.72,66.24 B1.1

### Text on the board
Top: PHOBOS EnsembleNine v1.1h
Document: (human fabrication)
tSilk: BOWLS | MEDALS | SHAKERS | WOOD